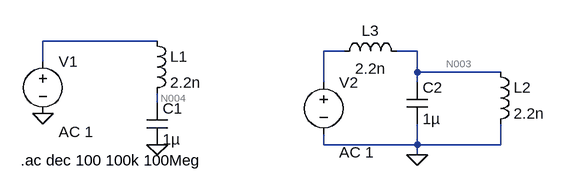
[diagram p0: schematic Draft3.asc]
Draft3.asc, the LTspice schematic file:
Version 4
SHEET 1 880 680
WIRE 208 112 32 112
WIRE 496 128 464 128
WIRE 608 128 576 128
WIRE 32 144 32 112
WIRE 608 160 608 128
WIRE 736 160 608 160
WIRE 464 176 464 128
WIRE 608 176 608 160
WIRE 208 208 208 192
WIRE 464 272 464 256
WIRE 608 272 608 240
WIRE 608 272 464 272
WIRE 736 272 736 240
WIRE 736 272 608 272
WIRE 608 288 608 272
FLAG 208 272 0
FLAG 32 224 0
FLAG 608 288 0
SYMBOL ind 192 96 R0
SYMATTR InstName L1
SYMATTR Value 2.2n
SYMBOL cap 192 208 R0
SYMATTR InstName C1
SYMATTR Value 1µ
SYMBOL voltage 32 128 R0
WINDOW 123 24 124 Left 2
WINDOW 39 0 0 Left 0
SYMATTR InstName V1
SYMATTR Value ""
SYMATTR Value2 AC 1
SYMBOL voltage 464 160 R0
WINDOW 123 24 124 Left 2
WINDOW 39 0 0 Left 0
SYMATTR InstName V2
SYMATTR Value ""
SYMATTR Value2 AC 1
SYMBOL cap 592 176 R0
SYMATTR InstName C2
SYMATTR Value 1µ
SYMBOL ind 720 144 R0
SYMATTR InstName L2
SYMATTR Value 2.2n
SYMBOL ind 480 144 R270
WINDOW 0 32 56 VTop 2
WINDOW 3 5 56 VBottom 2
SYMATTR InstName L3
SYMATTR Value 2.2n
TEXT -2 296 Left 2 !.ac dec 100 100k 100Meg

The netlist it stands for:
* Draft3.asc
L1 N001 N004 2.2n
C1 N004 0 1µ
V1 N001 0 AC 1
V2 N002 0 AC 1
C2 N003 0 1µ
L2 N003 0 2.2n
L3 N002 N003 2.2n
.ac dec 100 100k 100Meg
.backanno
.end

* Results of the author's LTspice run, read from the files saved beside the schematic
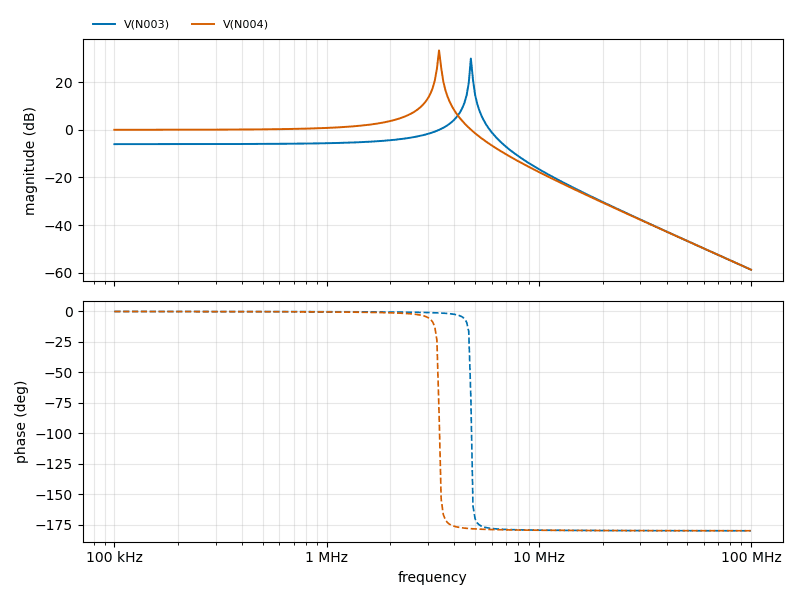
[diagram p1: AC Analysis of Draft3.asc, plotted from the saved traces]
* AC Analysis, 1 run:
*   V(N003): -6.02 dB at 100 kHz, -58.76 dB at 100 MHz, peak 29.95 dB at 4.786 MHz, 3 dB below the peak at 4.754 MHz and 4.824 MHz
*   V(N004): 0.01 dB at 100 kHz, -58.77 dB at 100 MHz, peak 33.36 dB at 3.388 MHz, 3 dB below the peak at 3.358 MHz and 3.421 MHz